# EAGLE design phase2 (EAGLE 6.5.0)
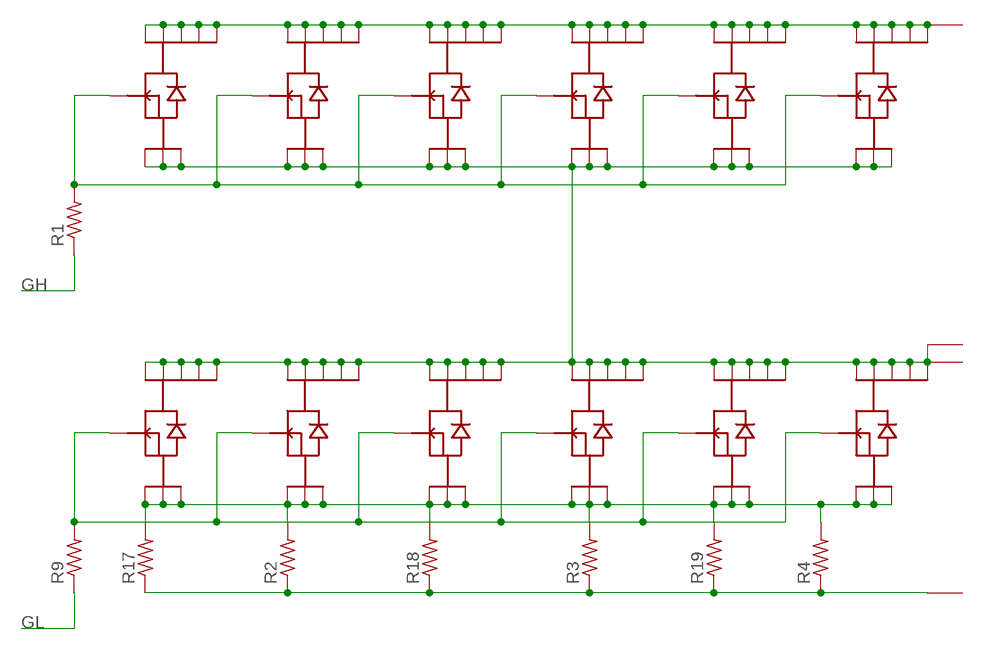
[diagram p0: schematic, sheet 1]

## Parts
R1  R-US_R1206  [R1206]
R2  R-US_M1206  [M1206]
R3  R-US_M1206  [M1206]
R4  R-US_M1206  [M1206]
R9  R-US_R1206  [R1206]
R17  R-US_M1206  [M1206]
R18  R-US_M1206  [M1206]
R19  R-US_M1206  [M1206]
U$1  TPH2R608NH  [SOP-ADVANCE]
U$2  TPH2R608NH  [SOP-ADVANCE]
U$3  TPH2R608NH  [SOP-ADVANCE]
U$4  TPH2R608NH  [SOP-ADVANCE]
U$5  TPH2R608NH  [SOP-ADVANCE]
U$6  TPH2R608NH  [SOP-ADVANCE]
U$9  TPH2R608NH  [SOP-ADVANCE]
U$10  TPH2R608NH  [SOP-ADVANCE]
U$11  TPH2R608NH  [SOP-ADVANCE]
U$12  TPH2R608NH  [SOP-ADVANCE]
U$13  TPH2R608NH  [SOP-ADVANCE]
U$14  TPH2R608NH  [SOP-ADVANCE]
U$17  BUSBAR  [BUSBAR]
U$18  BUSBAR  [BUSBAR]
U$19  BUSBAR  [BUSBAR]
U$20  POWERPAD  [POWERPAD]

## Nets
GH: R1.1
GL: R9.1
N$1: R1.2 U$1.4(G) U$2.4(G) U$3.4(G) U$4.4(G) U$5.4(G) U$6.4(G)
N$9: R9.2 U$9.4(G) U$10.4(G) U$11.4(G) U$12.4(G) U$13.4(G) U$14.4(G)
N$17: U$1.5(D1) U$1.6(D2) U$1.7(D3) U$1.8(D4) U$1.9(DTAB) U$2.5(D1) U$2.6(D2) U$2.7(D3) U$2.8(D4) U$2.9(DTAB) U$3.5(D1) U$3.6(D2) U$3.7(D3) U$3.8(D4) U$3.9(DTAB) U$4.5(D1) U$4.6(D2) U$4.7(D3) U$4.8(D4) U$4.9(DTAB) U$5.5(D1) U$5.6(D2) U$5.7(D3) U$5.8(D4) U$5.9(DTAB) U$6.5(D1) U$6.6(D2) U$6.7(D3) U$6.8(D4) U$6.9(DTAB) U$17.P$1
N$18: R2.1 R3.1 R4.1 R17.1 R18.1 R19.1 U$19.P$1
N$19: U$1.1(S1) U$1.2(S2) U$1.3(S3) U$2.1(S1) U$2.2(S2) U$2.3(S3) U$3.1(S1) U$3.2(S2) U$3.3(S3) U$4.1(S1) U$4.2(S2) U$4.3(S3) U$5.1(S1) U$5.2(S2) U$5.3(S3) U$6.1(S1) U$6.2(S2) U$6.3(S3) U$9.5(D1) U$9.6(D2) U$9.7(D3) U$9.8(D4) U$9.9(DTAB) U$10.5(D1) U$10.6(D2) U$10.7(D3) U$10.8(D4) U$10.9(DTAB) U$11.5(D1) U$11.6(D2) U$11.7(D3) U$11.8(D4) U$11.9(DTAB) U$12.5(D1) U$12.6(D2) U$12.7(D3) U$12.8(D4) U$12.9(DTAB) U$13.5(D1) U$13.6(D2) U$13.7(D3) U$13.8(D4) U$13.9(DTAB) U$14.5(D1) U$14.6(D2) U$14.7(D3) U$14.8(D4) U$14.9(DTAB) U$18.P$1 U$20.P$1
N$28: R2.2 R3.2 R4.2 R17.2 R18.2 R19.2 U$9.1(S1) U$9.2(S2) U$9.3(S3) U$10.1(S1) U$10.2(S2) U$10.3(S3) U$11.1(S1) U$11.2(S2) U$11.3(S3) U$12.1(S1) U$12.2(S2) U$12.3(S3) U$13.1(S1) U$13.2(S2) U$13.3(S3) U$14.1(S1) U$14.2(S2) U$14.3(S3)

## Library data of the parts
R1-R4 R9 R17-R19 = resistor:R-US_: RESISTOR, American symbol
U$1-U$6 U$9-U$14 = brushlessrage:TPH2R608NH
U$17-U$19 = brushlessrage:BUSBAR
U$20 = brushlessrage:POWERPAD

## Board
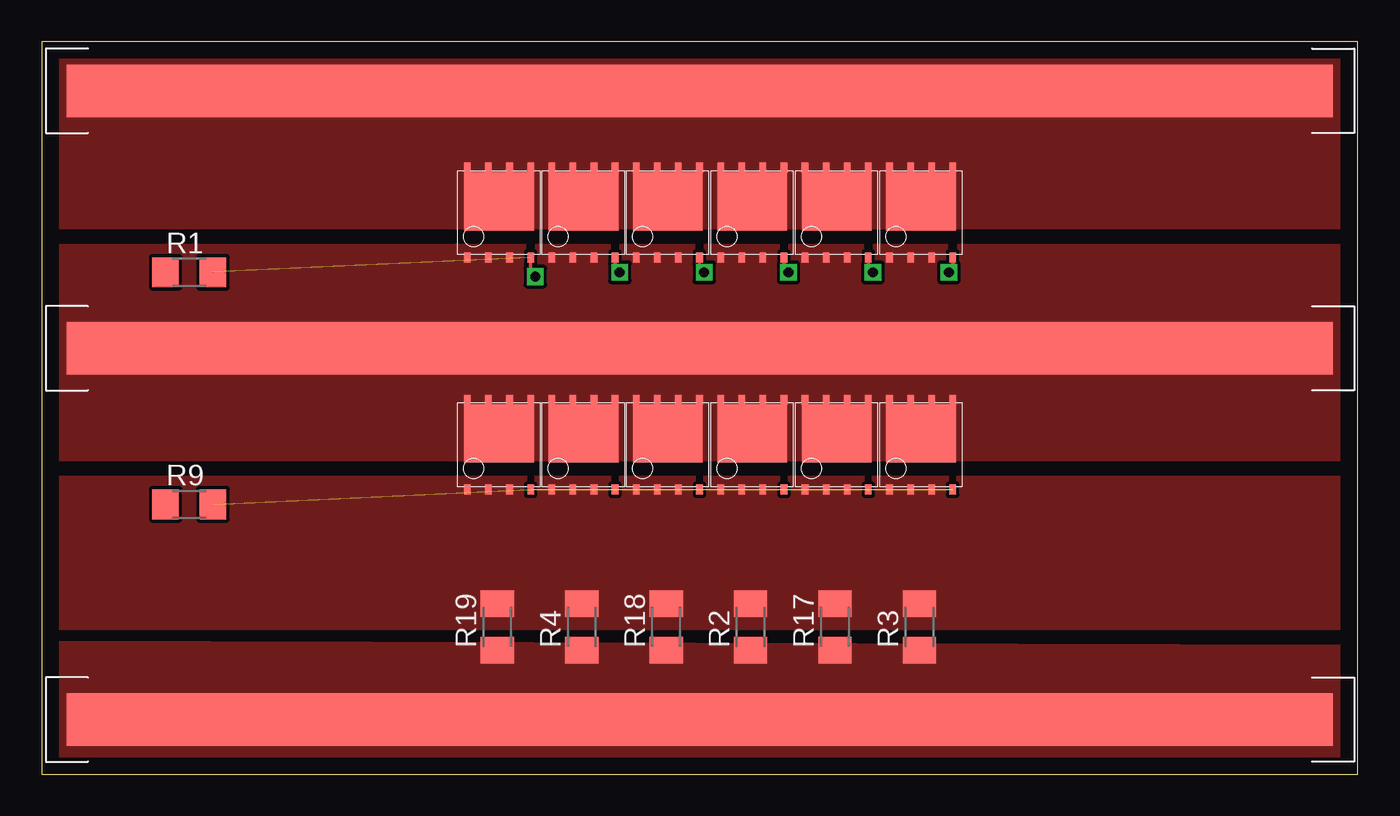
[diagram p1: board, top side]
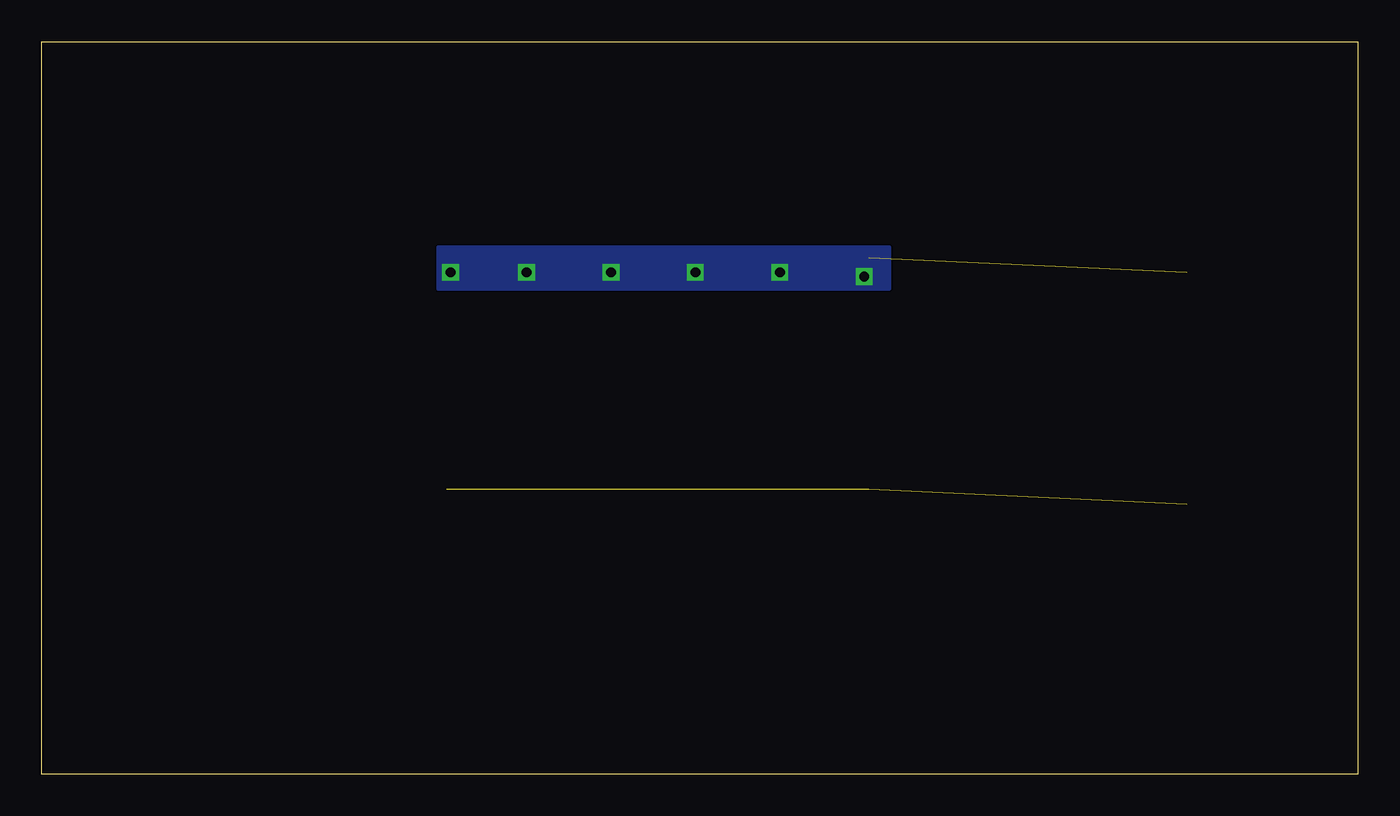
[diagram p2: board, bottom side, seen from below]

Size 79.23 x 44.12 mm. Coordinates in mm from the lower left corner, seen from the top.
Outline: 0,0 79.23,0 79.23,44.12 0,44.12 0,0
Copper layers (1*16): Top 0.035mm / dielectric 1.5mm / Bottom 0.035mm
Design rules "default": minimum track width 10mil, minimum drill 24mil, track to track 8mil, track to pad 8mil, pad to pad 8mil, via to via 8mil, smd to smd 8mil, copper to edge 40mil, drill to drill 8mil, minimum pad ring 10mil, minimum via ring 8mil, stop-mask expansion 4mil, vias tented up to drill 0mil, thermal gap 10mil

### Footprints (pad centres in the part's own frame; a part is rotated, then mirrored left to right if it is on the bottom)
R1206 = smd 1.6 x 1.803: 1 -1.422,0; 2 1.422,0
M1206 = smd 1.6 x 2: 1 -1.4,0; 2 1.4,0
SOP-ADVANCE = smd 0.4 x 0.6: 1 -1.803,-3.175; 2 -0.533,-3.175; 3 0.737,-3.175; 4 2.007,-3.175; 5 2.007,2.235; 6 0.737,2.235; 7 -0.533,2.235; 8 -1.803,2.235 | smd 4.2 x 3.5: 9 0.102,0.203
BUSBAR = smd 76.2 x 3.175: P$1 0,0
POWERPAD = smd 12.7 x 3.175: P$1 0,0

### Placement (x,y rotation side)
R1  8.89,30.23 0 top
R2  42.67,8.89 90 top
R3  52.83,8.89 90 top
R4  32.51,8.89 90 top
R9  8.89,16.26 0 top
R17  47.75,8.89 90 top
R18  37.59,8.89 90 top
R19  27.43,8.89 90 top
U$1  27.43,34.29 0 top
U$2  32.51,34.29 0 top
U$3  37.59,34.29 0 top
U$4  42.67,34.29 0 top
U$5  47.75,34.29 0 top
U$6  52.83,34.29 0 top
U$9  42.67,20.32 0 top
U$10  37.59,20.32 0 top
U$11  32.51,20.32 0 top
U$12  27.43,20.32 0 top
U$13  47.75,20.32 0 top
U$14  52.83,20.32 0 top
U$17  39.62,41.15 0 top
U$18  39.62,25.65 0 top
U$19  39.62,3.3 0 top
U$20  71.37,25.65 0 top

### Tracks (layer width: path | path; a pad name or v marks a point on that pad's centre or on a via)
N$1  (via drill 0.6)  (1 unrouted)
  Top 0.203: U$1.4 29.44,30.25 v29.72,29.97 | U$2.4 34.52,30.51 v34.8,30.23 | U$3.4 39.6,30.51 v39.88,30.23 | U$4.4 44.68,30.51 v44.96,30.23 | U$5.4 49.76,30.51 v50.04,30.23 | U$6.4 54.84,30.45 v54.61,30.23
  pour Bottom: 28.19,31.75 55.37,31.75 55.37,29.21 28.19,29.21
N$9  (6 unrouted)
N$17
  pour Top (no thermals): 0.51,44.45 78.23,44.45 78.23,33.02 0.51,33.02
N$18
  pour Top (no thermals): 0.51,7.87 78.23,7.62 78.23,0 0.51,0.25
N$19
  pour Top (no thermals): 0.51,31.75 78.23,31.75 78.23,19.05 0.51,19.05
N$28
  pour Top (no thermals): 0.51,17.78 78.23,17.78 78.23,8.89 0.51,8.89